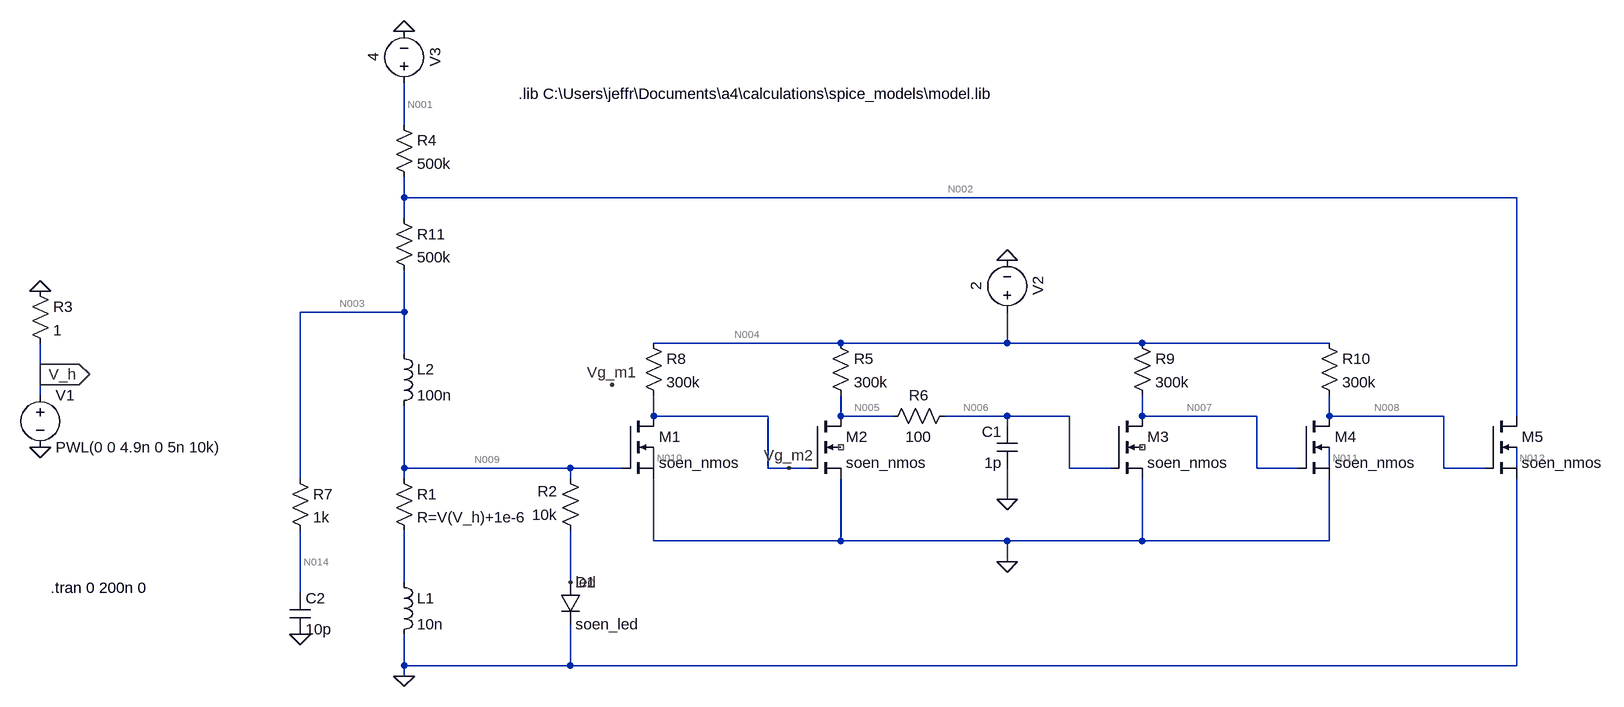
[diagram p0: schematic transmitter_mosfet.asc]
transmitter_mosfet.asc, the LTspice schematic file:
Version 4
SHEET 1 1408 680
WIRE -448 -592 -448 -656
WIRE -448 -480 -448 -512
WIRE 1264 -480 -448 -480
WIRE -448 -448 -448 -480
WIRE -448 -304 -448 -368
WIRE -448 -304 -608 -304
WIRE 224 -256 -64 -256
WIRE 480 -256 480 -304
WIRE 480 -256 224 -256
WIRE 688 -256 480 -256
WIRE 976 -256 688 -256
WIRE -448 -240 -448 -304
WIRE -1008 -208 -1008 -256
WIRE -1008 -176 -1008 -208
WIRE -64 -144 -64 -176
WIRE 112 -144 -64 -144
WIRE 224 -144 224 -176
WIRE 304 -144 224 -144
WIRE 480 -144 384 -144
WIRE 576 -144 480 -144
WIRE 688 -144 688 -176
WIRE 864 -144 688 -144
WIRE 976 -144 976 -176
WIRE 1152 -144 976 -144
WIRE 1264 -144 1264 -480
WIRE 480 -128 480 -144
WIRE -448 -64 -448 -160
WIRE -192 -64 -448 -64
WIRE -112 -64 -192 -64
WIRE -64 -64 -64 -96
WIRE 112 -64 112 -144
WIRE 144 -64 112 -64
WIRE 176 -64 144 -64
WIRE 576 -64 576 -144
WIRE 640 -64 576 -64
WIRE 864 -64 864 -144
WIRE 928 -64 864 -64
WIRE 976 -64 976 -96
WIRE 1152 -64 1152 -144
WIRE 1216 -64 1152 -64
WIRE 1264 -64 1264 -96
WIRE -608 -48 -608 -304
WIRE -448 -48 -448 -64
WIRE -192 -48 -192 -64
WIRE 480 -16 480 -64
WIRE -64 48 -64 -48
WIRE 224 48 224 -48
WIRE 224 48 -64 48
WIRE 480 48 224 48
WIRE 688 48 688 -48
WIRE 688 48 480 48
WIRE 976 48 976 -48
WIRE 976 48 688 48
WIRE 480 80 480 48
WIRE -448 112 -448 32
WIRE -192 112 -192 32
WIRE -608 128 -608 32
WIRE -448 240 -448 192
WIRE -192 240 -192 176
WIRE -192 240 -448 240
WIRE 1264 240 1264 -48
WIRE 1264 240 -192 240
WIRE -448 256 -448 240
FLAG -448 256 0
FLAG -128 -192 Vg_m1
FLAG -1008 -336 0
FLAG -1008 -96 0
FLAG -1008 -208 V_h
IOPIN -1008 -208 Out
FLAG 480 -384 0
FLAG -192 112 led
FLAG 144 -64 Vg_m2
FLAG 480 -16 0
FLAG 480 80 0
FLAG -448 -736 0
FLAG -608 192 0
SYMBOL res -464 -64 R0
SYMATTR InstName R1
SYMATTR Value R=V(V_h)+1e-6
SYMBOL res -176 48 R180
WINDOW 0 36 76 Left 2
WINDOW 3 36 40 Left 2
SYMATTR InstName R2
SYMATTR Value 10k
SYMBOL ind -464 96 R0
SYMATTR InstName L1
SYMATTR Value 10n
SYMBOL voltage -1008 -192 R0
WINDOW 123 0 0 Left 0
WINDOW 39 0 0 Left 0
SYMATTR InstName V1
SYMATTR Value PWL(0 0 4.9n 0 5n 10k)
SYMBOL res -1024 -352 R0
SYMATTR InstName R3
SYMATTR Value 1
SYMBOL voltage 480 -288 R180
WINDOW 0 -32 56 VBottom 2
WINDOW 3 32 56 VTop 2
WINDOW 123 0 0 Left 0
WINDOW 39 0 0 Left 0
SYMATTR InstName V2
SYMATTR Value 2
SYMBOL nmos4 -112 -144 R0
SYMATTR InstName M1
SYMATTR Value soen_nmos
SYMATTR Value2 l=1u w=10u
SYMBOL diode -208 112 R0
SYMATTR InstName D1
SYMATTR Value soen_led
SYMBOL res -464 -608 R0
SYMATTR InstName R4
SYMATTR Value 500k
SYMBOL cap 496 -64 R180
WINDOW 0 24 56 Left 2
WINDOW 3 24 8 Left 2
SYMATTR InstName C1
SYMATTR Value 1p
SYMBOL nmos4 640 -144 R0
SYMATTR InstName M3
SYMATTR Value soen_nmos
SYMATTR Value2 l=1u w=10u
SYMBOL cap -624 128 R0
SYMATTR InstName C2
SYMATTR Value 10p
SYMBOL res -624 -64 R0
SYMATTR InstName R7
SYMATTR Value 1k
SYMBOL res -80 -272 R0
SYMATTR InstName R8
SYMATTR Value 300k
SYMBOL nmos4 176 -144 R0
SYMATTR InstName M2
SYMATTR Value soen_nmos
SYMATTR Value2 l=1u w=10u
SYMBOL res 400 -160 R90
WINDOW 0 0 56 VBottom 2
WINDOW 3 32 56 VTop 2
SYMATTR InstName R6
SYMATTR Value 100
SYMBOL nmos4 928 -144 R0
SYMATTR InstName M4
SYMATTR Value soen_nmos
SYMATTR Value2 l=1u w=10u
SYMBOL nmos4 1216 -144 R0
SYMATTR InstName M5
SYMATTR Value soen_nmos
SYMATTR Value2 l=1u w=10u
SYMBOL res 208 -272 R0
SYMATTR InstName R5
SYMATTR Value 300k
SYMBOL res 672 -272 R0
SYMATTR InstName R9
SYMATTR Value 300k
SYMBOL res 960 -272 R0
SYMATTR InstName R10
SYMATTR Value 300k
SYMBOL voltage -448 -640 R180
WINDOW 0 -32 56 VBottom 2
WINDOW 3 32 56 VTop 2
WINDOW 123 0 0 Left 0
WINDOW 39 0 0 Left 0
SYMATTR InstName V3
SYMATTR Value 4
SYMBOL res -464 -464 R0
SYMATTR InstName R11
SYMATTR Value 500k
SYMBOL ind -464 -256 R0
SYMATTR InstName L2
SYMATTR Value 100n
TEXT -272 -640 Left 2 !.lib C:\\Users\\jeffr\\Documents\\a4\\calculations\\spice_models\\model.lib
TEXT -992 120 Left 2 !.tran 0 200n 0

The netlist it stands for:
* transmitter_mosfet.asc
R1 N009 N013 R=V(V_h)+1e-6
R2 led N009 10k
L1 N013 0 10n
V1 V_h 0 PWL(0 0 4.9n 0 5n 10k)
R3 0 V_h 1
V2 N004 0 2
M1 Vg_m2 N009 0 N010 soen_nmos l=1u w=10u
D1 led 0 soen_led
R4 N001 N002 500k
C1 0 N006 1p
M3 N007 N006 0 NC_01 soen_nmos l=1u w=10u
C2 N014 0 10p
R7 N003 N014 1k
R8 N004 Vg_m2 300k
M2 N005 Vg_m2 0 NC_02 soen_nmos l=1u w=10u
R6 N006 N005 100
M4 N008 N007 0 N011 soen_nmos l=1u w=10u
M5 N002 N008 0 N012 soen_nmos l=1u w=10u
R5 N004 N005 300k
R9 N004 N007 300k
R10 N004 N008 300k
V3 N001 0 4
R11 N002 N003 500k
L2 N003 N009 100n
.model D D
.lib standard.dio
.model NMOS NMOS
.model PMOS PMOS
.lib standard.mos
.lib C:\Users\jeffr\Documents\a4\calculations\spice_models\model.lib
.tran 0 200n 0
.backanno
.end

* Results of the author's LTspice run, read from the files saved beside the schematic
* Operating Point, zero values left out:
*   V(n009) = 4.004 nV
*   V(led) = 4.004 nV
*   V(n004) = 2 V
*   V(vg_m2) = 2 V
*   V(n010) = 131.7 mV
*   V(n001) = 4 V
*   V(n002) = 2 V
*   V(n006) = 32.77 mV
*   V(n007) = 2 V
*   V(n014) = 8.004 nV
*   V(n003) = 8.004 nV
*   V(n005) = 32.77 mV
*   V(n008) = 32.77 mV
*   V(n011) = 11.04 mV
*   V(n012) = 131.7 mV
*   I(R1) = 4 µA
*   Id(M5) = 3.878 pA
*   Is(M5) = -3.747 pA
*   Id(M4) = 6.557 µA
*   Is(M4) = -6.557 µA
*   Id(M2) = 6.557 µA
*   Is(M2) = -6.557 µA
*   Id(M3) = 3.878 pA
*   Is(M3) = -3.747 pA
*   Id(M1) = 3.878 pA
*   Is(M1) = -3.747 pA
*   I(L2) = 4 µA
*   I(L1) = 4 µA
*   I(R11) = 4 µA
*   I(R10) = 6.557 µA
*   I(R9) = 3.878 pA
*   I(R5) = 6.557 µA
*   I(R8) = 3.878 pA
*   I(R4) = 4 µA
*   I(V3) = -4 µA
*   I(V2) = -13.11 µA
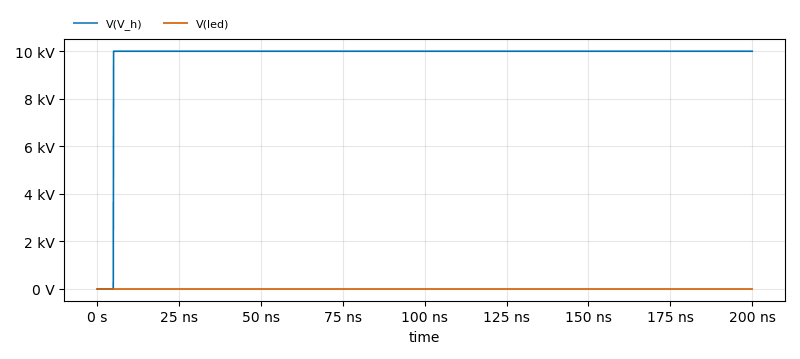
[diagram p1: Transient Analysis of transmitter_mosfet.asc, plotted from the saved traces]
* Transient Analysis, 1 run:
*   V(V_h): min 0 V, max 10 kV, average 9.752 kV, rms 9.875 kV, last 10 kV
*   V(led): min 4.004 nV, max 33.58 mV, average 22.27 mV, rms 24.05 mV, last 33.58 mV